# Altium schematic sheet MCU.SchDoc: Microcontroller Unit
size A3; Author: Khoi Ly; DrawnBy: Khoi Ly; Organization: University of Colorado; Address1: 1111 Engineering Drive; Address2: Boulder; Address3: CO, 870309; Address4: USA; DocumentNumber: 1; Revision: 1; SheetNumber: 4; SheetTotal: 4; DocumentName: MCU.SchDoc
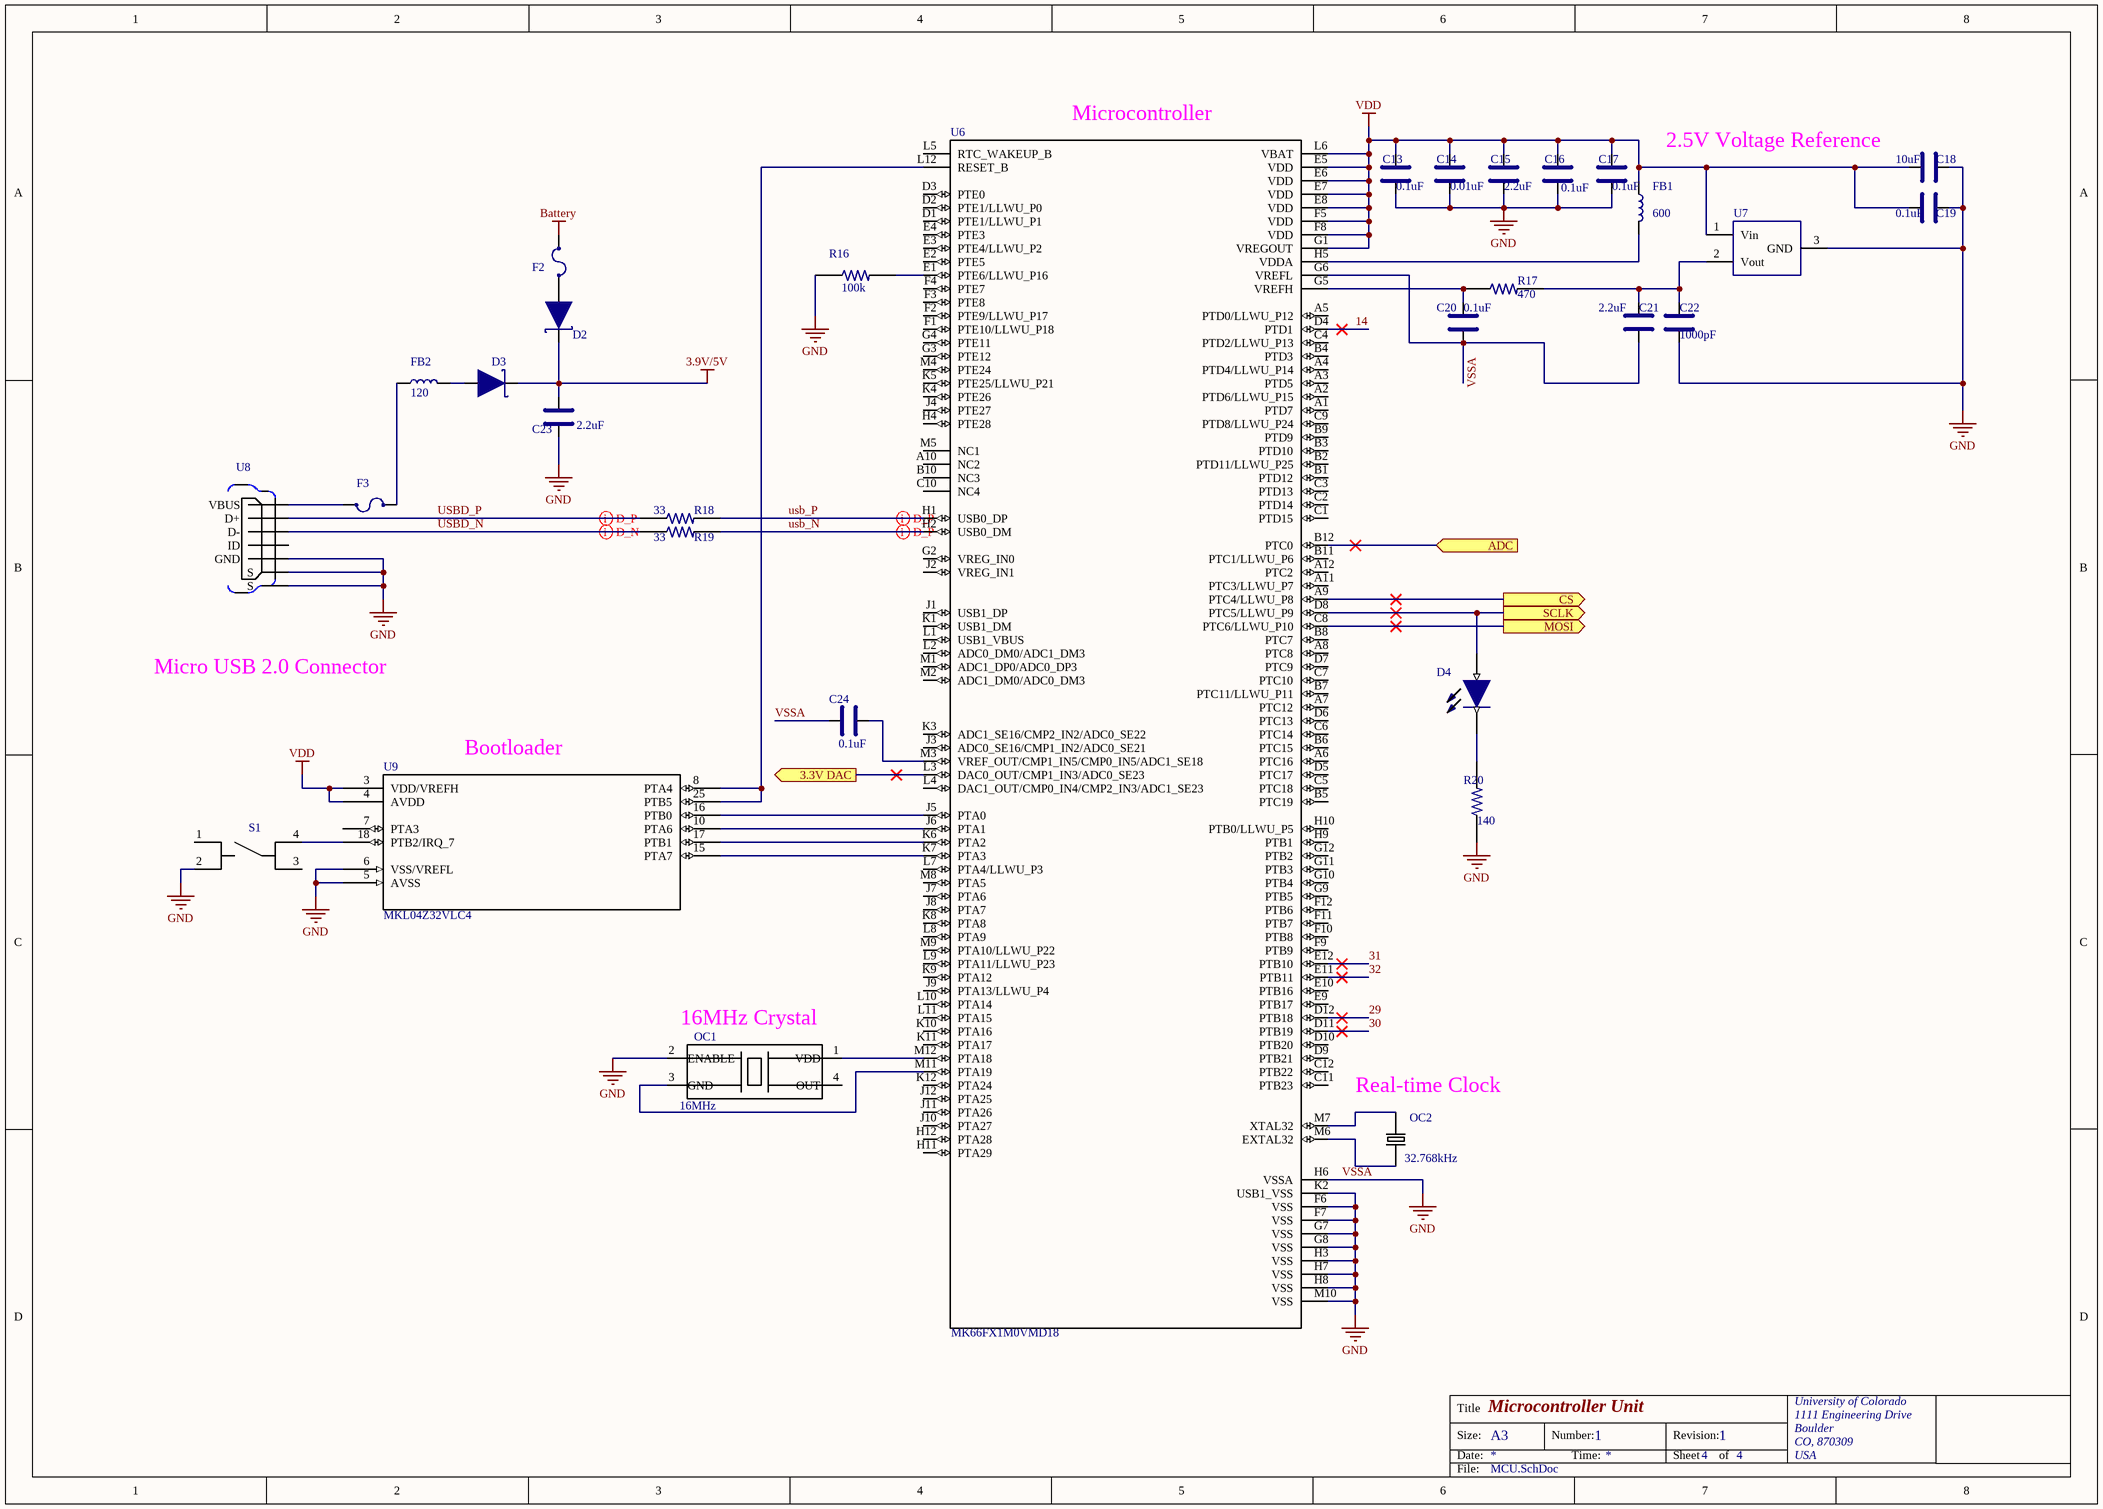
[diagram p0: MCU.SchDoc]

## Parts
C13  value 0.1uF  [CL03A104KA3NNNC]  (hidden comment: CL03A104KA3NNNC)
C14  value 0.01uF  [CL03B103KP3NNNC]  (hidden comment: CL03B103KP3NNNC)
C15  value 2.2uF  [CL03A225MP3CRNC]  (hidden comment: CL03A225MP3CRNC)
C16  value 0.1uF  [CL03A104KA3NNNC]  (hidden comment: CL03A104KA3NNNC)
C17  value 0.1uF  [CL03A104KA3NNNC]  (hidden comment: CL03A104KA3NNNC)
C18  value 10uF  [GRM155R60J106ME47D]  (hidden comment: GRM155R60J106ME47D)
C19  value 0.1uF  [CL03A104KA3NNNC]  (hidden comment: CL03A104KA3NNNC)
C20  value 0.1uF  [CL03A104KA3NNNC]  (hidden comment: CL03A104KA3NNNC)
C21  value 2.2uF  [CL03A225MP3CRNC]  (hidden comment: CL03A225MP3CRNC)
C22  value 1000pF  [C0402C102K9RACTU]  (hidden comment: C0402C102K9RACTU)
C23  value 2.2uF  [CL03A225MP3CRNC]  (hidden comment: CL03A225MP3CRNC)
C24  value 0.1uF  [CL03A104KA3NNNC]  (hidden comment: CL03A104KA3NNNC)
D2  LSM115JE3/TR13  [LSM115JE3/TR13]  (value not drawn)
D3  LSM115JE3/TR13  [LSM115JE3/TR13]  (value not drawn)
D4  SML-LXFM0603SUGCTR  [SML-LXFM0603SUGCTR]  (value not drawn)
F2  ERB-SD0R50U  [ERB-SD0R50U]  (value not drawn)
F3  ERB-SD0R50U  [ERB-SD0R50U]  (value not drawn)
FB1  value 600  [BLM15PX601SN1D]  (hidden comment: BLM15PX601SN1D)
FB2  value 120  [MPZ0603S121HT000]  (hidden comment: MPZ0603S121HT000)
OC1  value 16MHz  [TSX-3225 16.0000MF18X-AC3]  (hidden comment: TSX-3225 16.0000MF18X-AC3)
OC2  value 32.768kHz  [ECS-.327-9-34QS-TR]  (hidden comment: ECS-.327-9-34QS-TR)
R16  value 100k  [RC0201FR-07100KL]  (hidden comment: RC0201FR-07100KL)
R17  value 470  [RC0201JR-07470RL]  (hidden comment: RC0201JR-07470RL)
R18  value 33  [RC0201JR-0733RL]  (hidden comment: RC0201JR-0733RL)
R19  value 33  [RC0201JR-0733RL]  (hidden comment: RC0201JR-0733RL)
R20  value 140  [RC0201FR-07140RL]  (hidden comment: RC0201FR-07140RL)
S1  KMR231NG LFS  [KMR221GLFS]  (value not drawn)
U6  MK66FX1M0VMD18  [MK66FX1M0VMD18]
U7  ISL60002BIH325Z-T7A  [ISL60002-25]  (value not drawn)
U8  10118192-0001LF  [10118192-0001LF]  (value not drawn)
U9  MKL04Z32VLC4  [MKL04Z32VLC4-ND]

## Ports
3.3V DAC (out), ADC (in), CS (out), MOSI (out), SCLK (out)

## Nets
3.9V/5V: C23.1 D2.1 D3.1
Battery: F2.1(In)
VDD: C13.1 C14.1 C15.1 C16.1 C17.1 C18.2 C19.1 FB1.1 U6.E5(VDD) U6.E6(VDD) U6.E7(VDD) U6.E8(VDD) U6.F5(VDD) U6.F8(VDD) U6.G1(VREGOUT) U6.L6(VBAT) U7.1(Vin) U9.3(VDD/VREFH) U9.4(AVDD)
VSSA: C13.2 C14.2 C15.2 C16.2 C17.2 C18.1 C19.2 C20.2 C21.1 C22.2 C23.2 C24.1 OC1.2(ENABLE) R16.2 R20.2 S1.2 U6.F6(VSS) U6.F7(VSS) U6.G6(VREFL) U6.G7(VSS) U6.G8(VSS) U6.H3(VSS) U6.H6(VSSA) U6.H7(VSS) U6.H8(VSS) U6.K2(USB1_VSS) U6.M10(VSS) U7.3(GND) U8.5(GND) U8.6(S) U8.7(S) U9.5(AVSS) U9.6(VSS/VREFL)  [also labelled GND]
3.3V DAC: U6.L3(DAC0_OUT/CMP1_IN3/ADC0_SE23) ; port 3.3V DAC
14: U6.D4(PTD1)
29: U6.D12(PTB18)
30: U6.D11(PTB19)
31: U6.E12(PTB10)
32: U6.E11(PTB11)
ADC: U6.B12(PTC0) ; port ADC
CS: U6.A9(PTC4/LLWU_P8) ; port CS
MOSI: U6.C8(PTC6/LLWU_P10) ; port MOSI
SCLK: D4.1(A) U6.D8(PTC5/LLWU_P9) ; port SCLK
usb_N: R19.1 U6.H2(USB0_DM)
usb_P: R18.1 U6.H1(USB0_DP)
USBD_N: R19.2 U8.2(D-)
USBD_P: R18.2 U8.3(D+)
NetC20_1: C20.1 R17.2 U6.G5(VREFH)
NetC21_2: C21.2 C22.1 R17.1 U7.2(Vout)
NetC24_2: C24.2 U6.M3(VREF_OUT/CMP1_IN5/CMP0_IN5/ADC1_SE18)
NetD2_2: D2.2 F2.2(Out)
NetD3_2: D3.2 FB2.2
NetD4_2: D4.2(K) R20.1
NetF3_1: F3.1(In) FB2.1
NetF3_2: F3.2(Out) U8.1(VBUS)
NetFB1_2: FB1.2 U6.H5(VDDA)
NetOC1_1: OC1.1(VDD) U6.M12(PTA18)
NetOC1_3: OC1.3(GND) U6.M11(PTA19)
NetOC2_1: OC2.1(I/O) U6.M6(EXTAL32)
NetOC2_2: OC2.2(O/I) U6.M7(XTAL32)
NetR16_1: R16.1 U6.E1(PTE6/LLWU_P16)
NetS1_4: S1.4 U9.18(PTB2/IRQ_7)
NetU6_J5: U6.J5(PTA0) U9.16(PTB0)
NetU6_J6: U6.J6(PTA1) U9.10(PTA6)
NetU6_K6: U6.K6(PTA2) U9.17(PTB1)
NetU6_K7: U6.K7(PTA3) U9.15(PTA7)
NetU6_L12: U6.L12(RESET_B) U9.8(PTA4) U9.25(PTB5)

Not connected (* = marked no-connect by the designer): OC1 4(OUT); S1 1 3; U6 A1(PTD7) A2(PTD6/LLWU_P15) A3(PTD5) A4(PTD4/LLWU_P14) A5(PTD0/LLWU_P12) A6(PTC16) A7(PTC12) A8(PTC8) A10(NC2) A11(PTC3/LLWU_P7) A12(PTC2) B1(PTD12) B2(PTD11/LLWU_P25) B3(PTD10) B4(PTD3) B5(PTC19) B6(PTC15) B7(PTC11/LLWU_P11) B8(PTC7) B9(PTD9) B10(NC3) B11(PTC1/LLWU_P6) C1(PTD15) C2(PTD14) C3(PTD13) C4(PTD2/LLWU_P13) C5(PTC18) C6(PTC14) C7(PTC10) C9(PTD8/LLWU_P24) C10(NC4) C11(PTB23) C12(PTB22) D1(PTE1/LLWU_P1) D2(PTE1/LLWU_P0) D3(PTE0) D5(PTC17) D6(PTC13) D7(PTC9) D9(PTB21) D10(PTB20) E2(PTE5) E3(PTE4/LLWU_P2) E4(PTE3) E9(PTB17) E10(PTB16) F1(PTE10/LLWU_P18) F2(PTE9/LLWU_P17) F3(PTE8) F4(PTE7) F9(PTB9) F10(PTB8) F11(PTB7) F12(PTB6) G2(VREG_IN0) G3(PTE12) G4(PTE11) G9(PTB5) G10(PTB4) G11(PTB3) G12(PTB2) H4(PTE28) H9(PTB1) H10(PTB0/LLWU_P5) H11(PTA29) H12(PTA28) J1(USB1_DP) J2(VREG_IN1) J3(ADC0_SE16/CMP1_IN2/ADC0_SE21) J4(PTE27) J7(PTA6) J8(PTA7) J9(PTA13/LLWU_P4) J10(PTA27) J11(PTA26) J12(PTA25) K1(USB1_DM) K3(ADC1_SE16/CMP2_IN2/ADC0_SE22) K4(PTE26) K5(PTE25/LLWU_P21) K8(PTA8) K9(PTA12) K10(PTA16) K11(PTA17) K12(PTA24) L1(USB1_VBUS) L2(ADC0_DM0/ADC1_DM3) L4(DAC1_OUT/CMP0_IN4/CMP2_IN3/ADC1_SE23) L5(RTC_WAKEUP_B) L7(PTA4/LLWU_P3) L8(PTA9) L9(PTA11/LLWU_P23) L10(PTA14) L11(PTA15) M1(ADC1_DP0/ADC0_DP3) M2(ADC1_DM0/ADC0_DM3) M4(PTE24) M5(NC1) M8(PTA5) M9(PTA10/LLWU_P22); U8 4(ID); U9 7(PTA3)

## Layout directives
differential pair: usb_N, usb_P, USBD_N, USBD_P

## Notes on the sheet
- (near U6) Microcontroller
- (near C18) 2.5V Voltage Reference
- Micro USB 2.0 Connector
- (near U9) Bootloader
- (near OC1) 16MHz Crystal
- (near OC2) Real-time Clock
- Title
- Size:
- Date:
- A3
- Number:
- Time:
- Revision:
- Sheet
- of
- File:

## Library data of the parts
C13 C16 C17 C19 C20 C24 = CL03A104KA3NNNC: CAP CER 0.1UF 25V X5R 0201; Manufacturer: Samsung; Package: 0201 (0603 Metric); Manufacturer Part Number: CL03A104KA3NNNC; Digikey Part Number: 1276-1318-6-ND; Voltage Rated: 25V; Temperature Coefficient: X5R; Unit Price: $0.75; Supplier: Digikey
C14 = CL03B103KP3NNNC: CAP CER 10000PF 10V X7R 0201; Manufacturer: Samsung; Package: 0201 (0603 Metric); Manufacturer Part Number: CL03B103KP3NNNC; Digikey Part Number: 1276-1152-1-ND; Voltage Rated: 10V; Temperature Coefficient: X7R; Unit Price: 0.13; Supplier: Digikey
C15 C21 C23 = CL03A225MP3CRNC: CAP CER 2.2UF 10V X5R 0201; Manufacturer: Samsung; Package: 0201 (0603 Metric); Manufacturer Part Number: CL03A225MP3CRNC; Digikey Part Number: 1276-6829-1-ND; Voltage Rated: 10V; Temperature Coefficient: X5R; Unit Price: $0.41; Supplier: Digikey
C18 = GRM155R60J106ME47D: CAP CER 10UF 6.3V X5R 0402; Manufacturer: Murata; Package: 0402 (1005 Metric); Manufacturer Part Number: GRM155R60J106ME47D; Digikey Part Number: 490-13239-1-ND; Voltage Rated: 6.3V; Temperature Coefficient: X5R; Unit Price: $0.85; Supplier: Digikey
C22 = C0402C102K9RACTU: CAP CER 1000PF 6.3V X7R 0402; Manufacturer: Murata; Manufacturer Part Number: GRM155R60J106ME47D; Package: 0402 (1005 Metric); Digikey Part Number: 399-8941-6-ND; Voltage Rated: 6.3V; Temperature Coefficient: X7R; Unit Price: $0.1; Supplier: Digikey
D2 D3 = LSM115JE3/TR13: DIODE SCHOTTKY 15V 1A DO214AC; Manufacturer: Microsemi; Forward Voltage: 220mV @ 1A; Package: DO-214AC; Manufacturer Part Number: LSM115JE3/TR13; Digikey Part Number: LSM115JE3/TR13CT-ND; Unit Price: $1.17; Supplier: Digikey; DC Reverse: 15V
D4 = SML-LXFM0603SUGCTR: LED GREEN CLEAR SMD; Manufacturer: Lumex Opto/Components Inc.; Wavelength: Green (571nm); Current: 10mA; Forward Voltage: 2.2; Package: 0603 (1608 Metric); Manufacturer Part Number: SML-LXFM0603SUGCTR; Digikey Part Number: 67-2320-1-ND; Unit Price: $1.06; Supplier: Digikey
F2 F3 = ERB-SD0R50U: FUSE BOARD MNT 500MA 24VDC 0402; Manufacturer: Panasonic; Package: 0402; Manufacturer Part Number: ERB-SD0R50U; Digikey Part Number: P11361CT-ND; Unit Price: $0.48; Supplier: Digikey; Forward Voltage: 500mA
FB1 = BLM15PX601SN1D: FERRITE BEAD 600 OHM 0402 1LN; Manufacturer: Murata; Current Rating: 900mA; Impedance @ Frequency: 600 Ohms @ 100MHz; Package: 0402 (1005 Metric); Manufacturer Part Number: BLM15PX601SN1D; Digikey Part Number: 445-180338-6-ND; Unit Price: $0.15; Supplier: Digikey
FB2 = MPZ0603S121HT000: CHIP BEADS FOR GENERAL SIGNAL LI; Manufacturer: TDK; Current Rating: 1A; Impedance @ Frequency: 120 Ohms @ 100MHz; Package: 0201 (0603 Metric); Manufacturer Part Number: MPZ0603S121HT000; Digikey Part Number: 445-180338-6-ND; Unit Price: $0.15; Supplier: Digikey
OC1 = TSX-3225 16.0000MF18X-AC3: CRYSTAL 16.0000MHZ 9PF SMD; Manufacturer: EPSON; Package: 4-SMD; Manufacturer Part Number: TSX-3225 16.0000MF18X-AC3; Digikey Part Number: SER3636CT-ND; Unit Price: $0.56; Supplier: Digikey
OC2 = ECS-.327-9-34QS-TR: CRYSTAL 32.768KHZ 9PF SMD; Manufacturer: ECS; Package: 2-SMD; Manufacturer Part Number: ECS-.327-9-34QS-TR; Digikey Part Number: XC2156DKR-ND; Unit Price: $0.74; Supplier: Digikey
R16 = RC0201FR-07100KL: RES SMD 100K OHM 1% 1/20W 0201; Manufacturer: Yageo; Power (Watts): 0.05W; Package: 0201 (0603 Metric); Manufacturer Part Number: RC0201FR-07100KL; Digikey Part Number: 311-100KMCT-ND; Unit Price: 0.1; Supplier: Digikey
R17 = RC0201JR-07470RL: RES SMD 470 OHM 5% 1/20W 0201; Manufacturer: Yageo; Power (Watts): 0.05W; Package: 0201 (0603 Metric); Manufacturer Part Number: RC0201JR-07470RL; Digikey Part Number: 311-470NCT-ND; Unit Price: 0.1; Supplier: Digikey
R18 R19 = RC0201JR-0733RL: RES SMD 33 OHM 5% 1/20W 0201; Manufacturer: Yageo; Power (Watts): 0.05W; Package: 0201 (0603 Metric); Manufacturer Part Number: RC0201JR-0733RL; Digikey Part Number: 311-33NCT-ND; Unit Price: 0.1; Supplier: Digikey
R20 = RC0201FR-07140RL: RES SMD 140 OHM 1% 1/20W 0201; Manufacturer: Yageo; Manufacturer Part Number: RC0201JR-0768RL; Power (Watts): 0.05W; Package: 0201 (0603 Metric); Digikey Part Number: YAG2406DKR-ND; Unit Price: 0.1; Supplier: Digikey
S1 = KMR231NG LFS: SWITCH TACTILE SPST-NO 0.02A 15V; Manufacturer: C&K; Package: SPST-NO; Manufacturer Part Number: KMR231NG LFS; Digikey Part Number: CKN10246TR-ND; Unit Price: $0.58; Supplier: Digikey
U6 = MK66FX1M0VMD18: Kinetis K66: 180MHz Cortex-M4F MCU, 1.2MB Flash, 256KB SRAM, 2xUSB, Ethernet, 144-MAPBGA; Manufacturer: NXP Semiconductors; Digikey Part Number: 568-13335-ND; Manufacturer Part Number: MK66FX1M0VMD18; Unit Price: $17.64; Package / Case: 144-LBGA
U7 = ISL60002BIH325Z-T7A: IC VREF SERIES 2.5V SOT23-3; Manufacturer: Renesas Electronics; Manufacturer Part Number: ISL60002BIH325Z-TK; Package: SOT-23-3; Digikey Part Number: ISL60002BIH325Z-T7ADKR-ND; Unit Price: $6.41; Supplier: Digikey
U8 = 10118192-0001LF: CONN USB MICRO B RECPT SMT R/A; Manufacturer: Amphenol FCL; Manufacturer Part Number: 10118192-0001LF; Digikey Part Number: 609-4613-1-ND; Unit Price: $0.42; Supplier: Digikey
U9 = MKL04Z32VLC4: IC MCU 32BIT 32KB FLASH 32LQFP; Manufacturer: NXP Semiconductors; Digikey Part Number: MKL04Z32VLC4-ND; Manufacturer Part Number: MKL04Z32VLC4; Unit Price: $2.51; Package / Case: 32-LQFP